# EAGLE schematic clt (EAGLE 9.2.2)
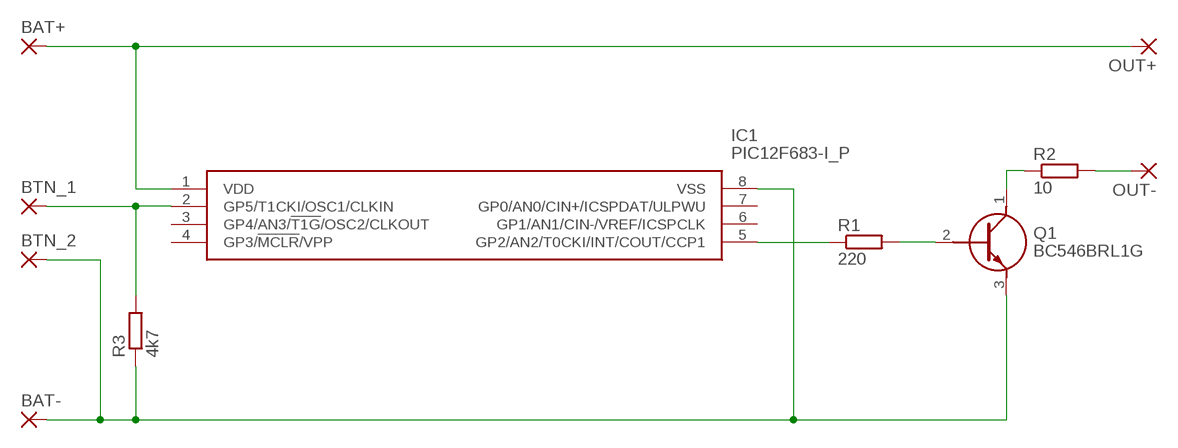
[diagram p0: schematic, sheet 1]

## Parts
BAT+  2,54/0,9  [2,54/0,9]
BAT-  2,54/0,9  [2,54/0,9]
BTN_1  2,54/0,9  [2,54/0,9]
BTN_2  2,54/0,9  [2,54/0,9]
IC1  PIC12F683-I_P  [DIP781W56P254L950H533Q8N]
OUT+  2,54/0,9  [2,54/0,9]
OUT-  2,54/0,9  [2,54/0,9]
Q1  BC546BRL1G  [TO-92]
R1  220  R-EU_0204/5  [0204/5]
R2  10  R-EU_0204/5  [0204/5]
R3  4k7  R-EU_0204/5  [0204/5]

## Nets
N$1: BAT-.1(P) BTN_2.1(P) IC1.8(VSS) Q1.3(E) R3.1
N$2: BAT+.1(P) IC1.1(VDD) OUT+.1(P)
N$3: IC1.5(GP2/AN2/T0CKI/INT/COUT/CCP1) R1.1
N$4: Q1.2(B) R1.2
N$5: Q1.1(C) R2.1
N$6: OUT-.1(P) R2.2
N$7: BTN_1.1(P) IC1.2(GP5/T1CKI/OSC1/CLKIN) R3.2
Unconnected: IC1.3(GP4/AN3/!T1G!/OSC2/CLKOUT) IC1.4(GP3/!MCLR!/VPP) IC1.6(GP1/AN1/CIN-/VREF/ICSPCLK) IC1.7(GP0/AN0/CIN+/ICSPDAT/ULPWU)

## Library data of the parts
BAT+ BAT- BTN_1 BTN_2 OUT+ OUT- = wirepad:2,54/0,9: THROUGH-HOLE PAD
IC1 = SamacSys_Parts:PIC12F683-I_P: 8-bit Microcontrollers - MCU 3.5KB 128 RAM 6 I/O Source: Datasheet <http://docs-emea.rs-online.com/webdocs/1381/0900766b81381af7.pdf>; ALLIED_NUMBER: 70045481; ALLIED_PRICE-STOCK: http://www.alliedelec.com/microchip-technology-inc-pic12f683-i-p/70045481/; DESCRIPTION: 8-bit Microcontrollers - MCU 3.5KB 128 RAM 6 I/O; HEIGHT: 5.334mm; MANUFACTURER_NAME: Microchip; MANUFACTURER_PART_NUMBER: PIC12F683-I/P; MOUSER_PART_NUMBER: 579-PIC12F683-I/P; MOUSER_PRICE-STOCK: https://www.mouser.com/Search/Refine.aspx?Keyword=579-PIC12F683-I%2FP; RS_PART_NUMBER: 8877151; RS_PRICE-STOCK: http://uk.rs-online.com/web/p/products/8877151
Q1 = SamacSys_Parts:BC546BRL1G: BC546BRL1G, NPN Bipolar Transistor, 100 mA 65 V HFE:200 300 MHz Amplifier, 3-Pin TO-92 Source: Datasheet <http://www.onsemi.com/pub/Collateral/BC546-D.PDF>; ALLIED_NUMBER: R1107233; ALLIED_PRICE-STOCK: http://www.alliedelec.com/on-semiconductor-bc546brl1g/R1107233/; DESCRIPTION: BC546BRL1G, NPN Bipolar Transistor, 100 mA 65 V HFE:200 300 MHz Amplifier, 3-Pin TO-92; HEIGHT: mm; MANUFACTURER_NAME: ON Semiconductor; MANUFACTURER_PART_NUMBER: BC546BRL1G; MOUSER_PART_NUMBER: 863-BC546BRL1G; RS_PART_NUMBER: 5449292P; RS_PRICE-STOCK: http://uk.rs-online.com/web/p/products/5449292P
R1-R3 = rcl:R-EU_: RESISTOR, European symbol; SPICEPREFIX: R